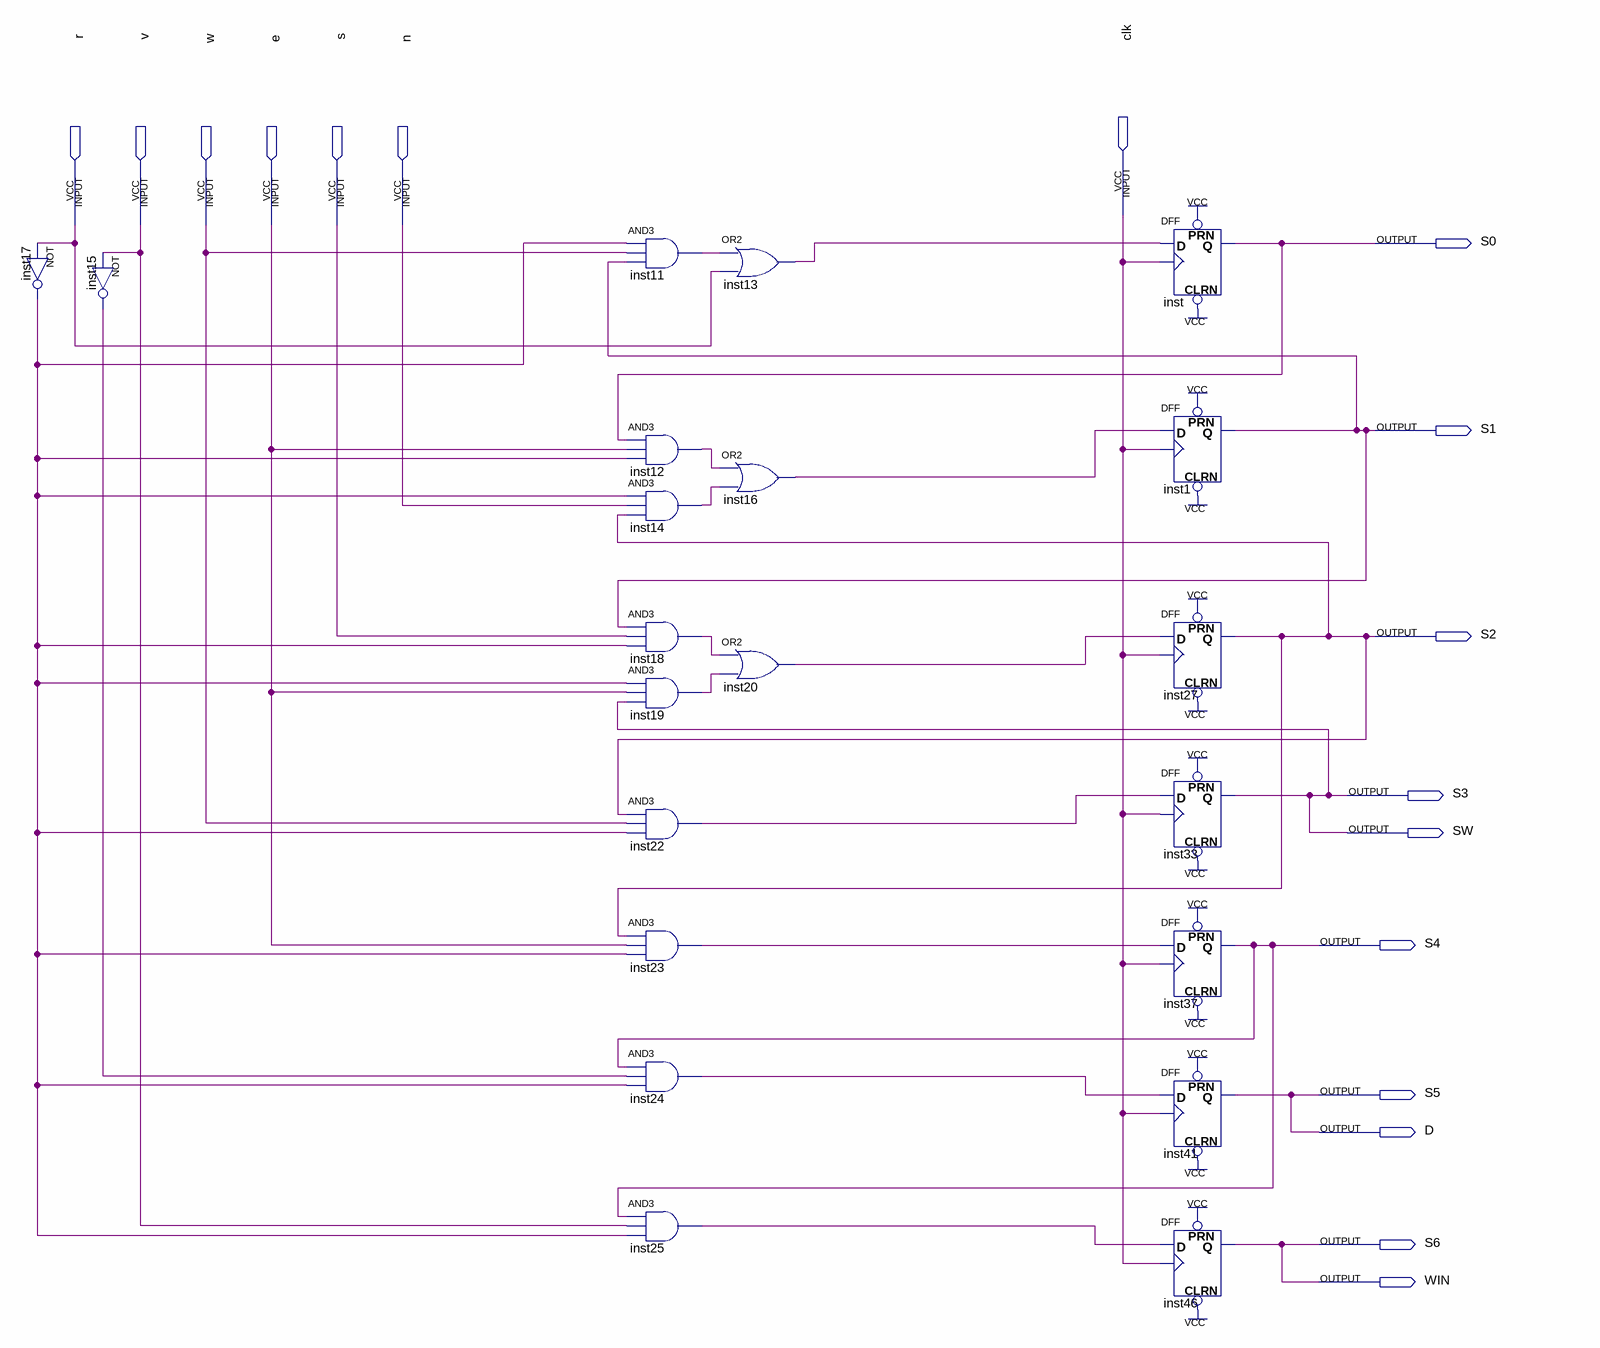
[diagram p0: schematic sheet]
// Quartus schematic room2.bdf as structural Verilog: 21 symbols, 17 pins
module room2 (
  input  clk,
  input  r,
  input  v,
  input  w,
  input  e,
  input  s,
  input  n,
  output S0,
  output S1,
  output S2,
  output S3,
  output SW,
  output S4,
  output S5,
  output D,
  output S6,
  output WIN
);

  wire inst11_out, inst12_out, inst13_out, inst14_out, inst15_out, inst16_out, inst17_out, inst18_out,
       inst19_out, inst20_out, inst22_out, inst23_out, inst24_out, inst25_out;

  not inst17 (inst17_out, r);
  not inst15 (inst15_out, v);
  and inst11 (inst11_out, inst17_out, w, S1);
  and inst12 (inst12_out, S0, e, inst17_out);
  and inst14 (inst14_out, inst17_out, n, S2);
  and inst18 (inst18_out, S1, s, inst17_out);
  and inst19 (inst19_out, inst17_out, e, S3);
  and inst22 (inst22_out, S2, w, inst17_out);
  and inst23 (inst23_out, S2, e, inst17_out);
  and inst24 (inst24_out, S4, inst15_out, inst17_out);
  and inst25 (inst25_out, S4, v, inst17_out);
  or inst13 (inst13_out, inst11_out, r);
  or inst16 (inst16_out, inst12_out, inst14_out);
  or inst20 (inst20_out, inst18_out, inst19_out);
  DFF inst (.CLRN(1'b1), .CLK(clk), .D(inst13_out), .PRN(1'b1), .Q(S0));
  DFF inst1 (.CLRN(1'b1), .CLK(clk), .D(inst16_out), .PRN(1'b1), .Q(S1));
  DFF inst27 (.CLRN(1'b1), .CLK(clk), .D(inst20_out), .PRN(1'b1), .Q(S2));
  DFF inst33 (.CLRN(1'b1), .CLK(clk), .D(inst22_out), .PRN(1'b1), .Q(S3));
  DFF inst37 (.CLRN(1'b1), .CLK(clk), .D(inst23_out), .PRN(1'b1), .Q(S4));
  DFF inst41 (.CLRN(1'b1), .CLK(clk), .D(inst24_out), .PRN(1'b1), .Q(D));
  DFF inst46 (.CLRN(1'b1), .CLK(clk), .D(inst25_out), .PRN(1'b1), .Q(S6));

  assign S5 = D;
  assign SW = S3;
  assign WIN = S6;
endmodule
